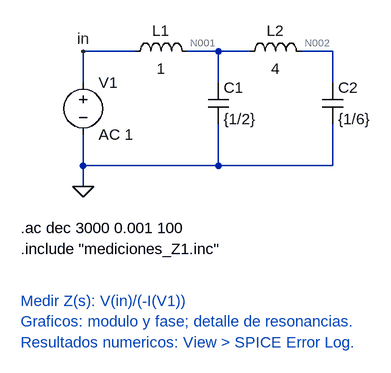
[diagram p0: schematic ejercicio1c.asc]
ejercicio1c.asc, the LTspice schematic file:
Version 4.1
SHEET 1 1000 760
WIRE 160 112 80 112
WIRE 288 112 240 112
WIRE 336 112 288 112
WIRE 464 112 416 112
WIRE 80 160 80 112
WIRE 288 160 288 112
WIRE 464 160 464 112
WIRE 80 288 80 240
WIRE 288 288 288 224
WIRE 288 288 80 288
WIRE 464 288 464 224
WIRE 464 288 288 288
WIRE 80 320 80 288
FLAG 80 320 0
SYMBOL voltage 80 144 R0
SYMATTR InstName V1
SYMATTR Value AC 1
SYMBOL ind 144 128 R270
WINDOW 0 32 56 VTop 2
WINDOW 3 5 56 VBottom 2
SYMATTR InstName L1
SYMATTR Value 1
SYMATTR SpiceLine Rser=0 Rpar=1e30
SYMBOL ind 320 128 R270
WINDOW 0 32 56 VTop 2
WINDOW 3 5 56 VBottom 2
SYMATTR InstName L2
SYMATTR Value 4
SYMATTR SpiceLine Rser=0 Rpar=1e30
SYMBOL cap 272 160 R0
SYMATTR InstName C1
SYMATTR Value {1/2}
SYMBOL cap 448 160 R0
SYMATTR InstName C2
SYMATTR Value {1/6}
FLAG 80 112 in
TEXT -16 384 Left 2 !.ac dec 3000 0.001 100
TEXT -16 416 Left 2 !.include "mediciones_Z1.inc"
TEXT -16 496 Left 2 ;Medir Z(s): V(in)/(-I(V1))
TEXT -16 528 Left 2 ;Graficos: modulo y fase; detalle de resonancias.
TEXT -16 560 Left 2 ;Resultados numericos: View > SPICE Error Log.

The netlist it stands for:
* ejercicio1c.asc
V1 in 0 AC 1
L1 in N001 1 Rser=0 Rpar=1e30
L2 N001 N002 4 Rser=0 Rpar=1e30
C1 N001 0 {1/2}
C2 N002 0 {1/6}
.ac dec 3000 0.001 100
.include "mediciones_Z1.inc"
* Medir Z(s): V(in)/(-I(V1))
* Graficos: modulo y fase; detalle de resonancias.
* Resultados numericos: View > SPICE Error Log.
.backanno
.end

* Results of the author's LTspice run, read from the files saved beside the schematic
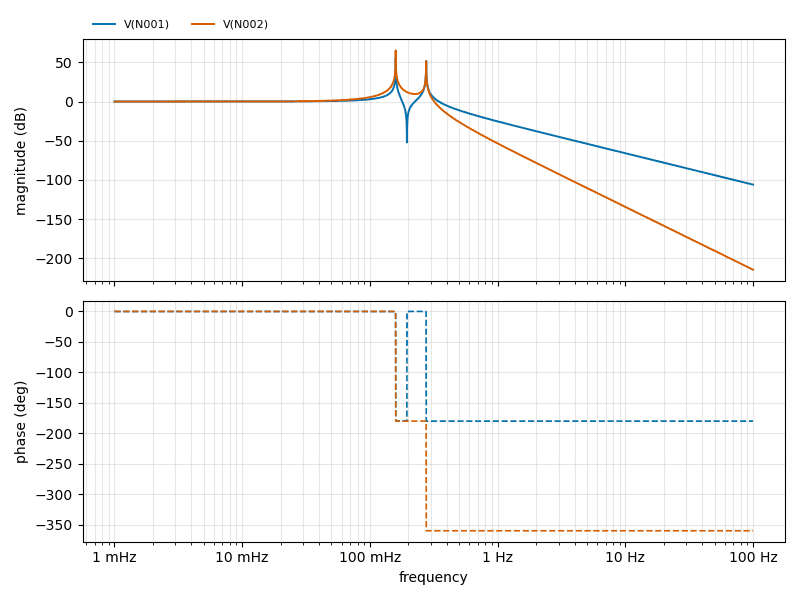
[diagram p1: AC Analysis of ejercicio1c.asc, plotted from the saved traces]
* AC Analysis, 1 run:
*   V(N001): 0.00 dB at 1 mHz, -105.91 dB at 100 Hz, peak 67.19 dB at 275.6 mHz, 3 dB below the peak at 275.6 mHz and 275.7 mHz
*   V(N002): 0.00 dB at 1 mHz, -214.31 dB at 100 Hz, peak 67.20 dB at 275.6 mHz, 3 dB below the peak at 275.6 mHz and 275.7 mHz